# Altium project ABLS-PCB-R01.PrjPcb
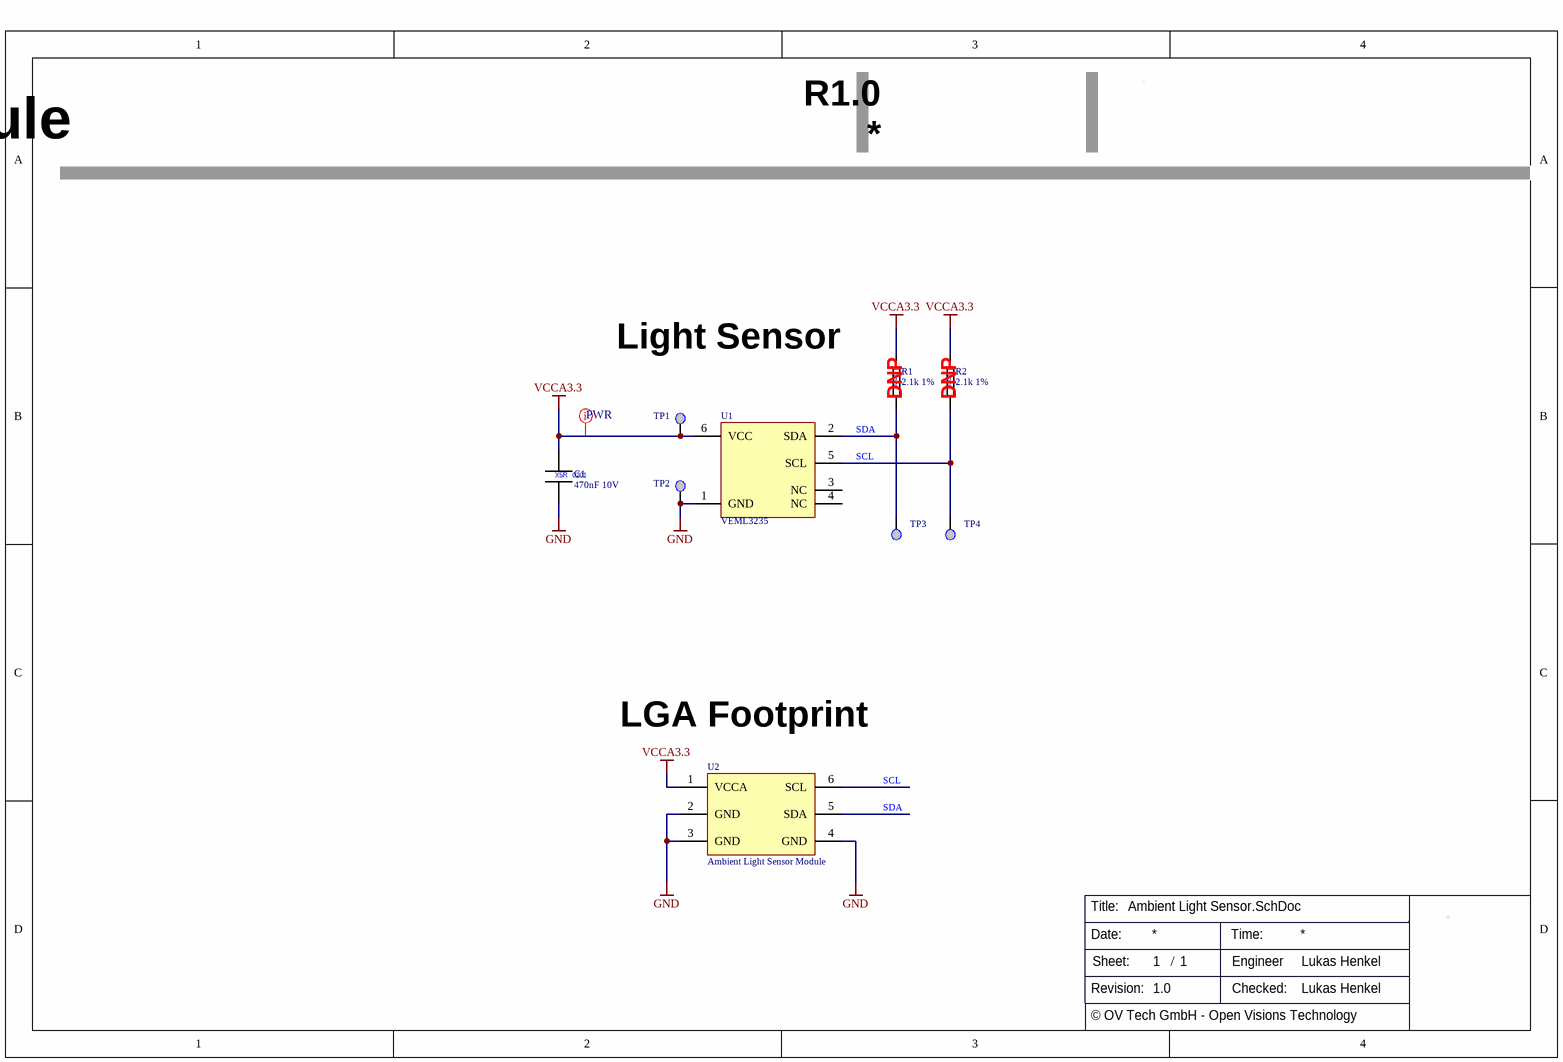
[diagram p0: Ambient Light Sensor.SchDoc]
1 sheet, 9 parts. Net scope: global (net labels, ports and power ports of the same name join across sheets).
Board file: ABLS-PCB-R01.PcbDoc

## Sheet Ambient Light Sensor.SchDoc
size A4; CheckedBy: Lukas Henkel; Engineer: Lukas Henkel; Revision: 1.0; SheetNumber: 1; SheetTotal: 1

### Parts
C1  470nF 10V  [CAPC0603X03L]
R1  2.1k 1%  [RESC0603X03L]
R2  2.1k 1%  [RESC0603X03L]
TP1  Testpoint 0.5mm  [TP_0.50mm]  (value not drawn)  (no BOM)
TP2  Testpoint 0.5mm  [TP_0.50mm]  (value not drawn)  (no BOM)
TP3  Testpoint 0.5mm  [TP_0.50mm]  (value not drawn)  (no BOM)
TP4  Testpoint 0.5mm  [TP_0.50mm]  (value not drawn)  (no BOM)
U1  VEML3235  [Light Sensor_VEML3235]
U2  Ambient Light Sensor Module  [ABLS-R01-sensor-Module Footprint]  (no BOM)

### Nets
GND: C1.2 TP2.TP U1.1(GND) U2.2(GND) U2.3(GND) U2.4(GND)
VCCA3.3: C1.1 R1.2 R2.2 TP1.TP U1.6(VCC) U2.1(VCCA)
SCL: R2.1 TP4.TP U1.5(SCL) U2.6(SCL)
SDA: R1.1 TP3.TP U1.2(SDA) U2.5(SDA)

Not connected (* = marked no-connect by the designer): U1 3(NC) 4(NC)

### Layout directives
net class PWR: VCCA3.3

### Notes on the sheet
- R1.0
- Ambient Light Sensor Module
- Light Sensor
- (near R1) DNP
- (near R2) DNP
- LGA Footprint
- Title:
- Date:
- Time:
- Revision:
- Sheet:
- /
- Engineer
- Checked:
- © OV Tech GmbH - Open Visions Technology
- (in symbol CAP_0201_470nF_10V) X5R; 0201
- (in symbol RES_0201_2.1k_1%) 0201

### Library data of the parts
C1 = CAP_0201_470nF_10V: Multilayer Ceramic Capacitors MLCC - SMD/SMT 0201 10VDC; Manufacturer 1: Taiyo Yuden; Manufacturer 1 Prt. Nr.: LMK063BBJ474KPLF; Manufacturer 2 Prt. Nr.: C0603X5R1A474M030BC; Manufacturer 2: TDK
R1 R2 = RES_0201_2.1k_1%: Thick Film Resistors - SMD 2.1K OHM 1%; Manufacturer 1: Panasonic; Manufacturer 1 Prt. Nr.: ERJ-1GNF2101C; Manufacturer 2 Prt. Nr.: RC0201FR-072K1L; Manufacturer 2: Yageo
U1 = Ambient Light Sensor_VEML3235: Ambient Light Sensors Low Power, High Sensitivity, I2C Ambient Light Sensor; Manufacturer 1: Vishay Semiconductors; Manufacturer 1 Prt. Nr.: VEML3235
U2 = ABLS-MOD-R01: Custom PCB Ambient Light Sensor LGA Footprint